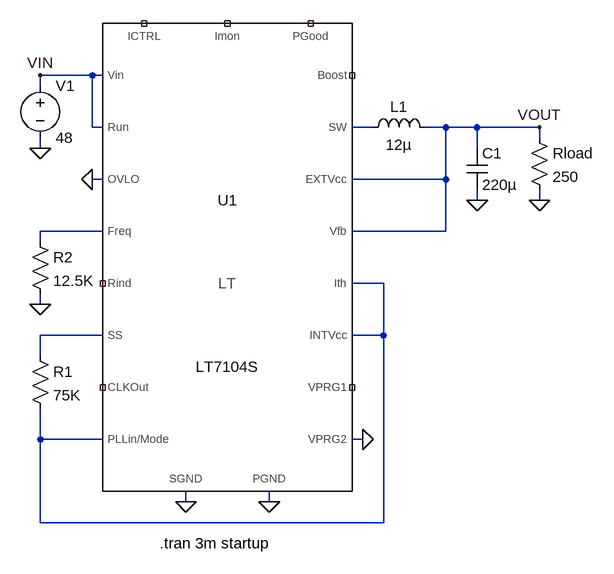
[diagram p0: schematic LT7104S.asc]
LT7104S.asc, the LTspice schematic file:
Version 4
SHEET 1 6140 3124
WIRE 608 -256 528 -256
WIRE 624 -256 608 -256
WIRE 528 -240 528 -256
WIRE 608 -176 608 -256
WIRE 624 -176 608 -176
WIRE 1040 -176 1008 -176
WIRE 1152 -176 1120 -176
WIRE 1200 -176 1152 -176
WIRE 1296 -176 1200 -176
WIRE 1296 -160 1296 -176
WIRE 528 -144 528 -160
WIRE 1200 -144 1200 -176
WIRE 624 -96 608 -96
WIRE 1152 -96 1152 -176
WIRE 1152 -96 1008 -96
WIRE 1200 -64 1200 -80
WIRE 1296 -64 1296 -80
WIRE 624 -16 528 -16
WIRE 1152 -16 1152 -96
WIRE 1152 -16 1008 -16
WIRE 528 0 528 -16
WIRE 1056 64 1008 64
WIRE 528 96 528 80
WIRE 624 144 528 144
WIRE 1056 144 1056 64
WIRE 1056 144 1008 144
WIRE 528 176 528 144
WIRE 528 304 528 256
WIRE 624 304 528 304
WIRE 1024 304 1008 304
WIRE 752 400 752 384
WIRE 880 400 880 384
WIRE 528 432 528 304
WIRE 1056 432 1056 144
WIRE 1056 432 528 432
FLAG 528 -144 0
FLAG 1296 -176 VOUT
FLAG 608 -96 0
FLAG 1296 -64 0
FLAG 1200 -64 0
FLAG 752 400 0
FLAG 880 400 0
FLAG 1024 304 0
FLAG 528 -256 VIN
FLAG 528 96 0
SYMBOL ind 1024 -160 R270
WINDOW 0 32 56 VTop 2
WINDOW 3 5 56 VBottom 2
SYMATTR InstName L1
SYMATTR Value 12µ
SYMATTR SpiceLine Rser=5m
SYMBOL cap 1184 -144 R0
SYMATTR Value 220µ
SYMATTR SpiceLine Rser=15m
SYMATTR InstName C1
SYMBOL voltage 528 -256 R0
WINDOW 123 0 0 Left 0
WINDOW 39 0 0 Left 0
SYMATTR InstName V1
SYMATTR Value 48
SYMBOL res 1280 -176 R0
SYMATTR InstName Rload
SYMATTR Value 250
SYMBOL res 512 -16 R0
SYMATTR InstName R2
SYMATTR Value 12.5K
SYMBOL res 512 160 R0
SYMATTR InstName R1
SYMATTR Value 75K
SYMBOL LT7104S 816 48 R0
SYMATTR InstName U1
TEXT 712 464 Left 2 !.tran 3m startup

The netlist it stands for:
* LT7104S.asc
L1 N001 VOUT 12µ Rser=5m
C1 VOUT 0 220µ Rser=15m
V1 VIN 0 48
Rload VOUT 0 250
R2 N002 0 12.5K
R1 N004 N003 75K
XU1 N001 NC_01 VIN VIN 0 0 0 NC_02 N003 VOUT N002 N003 NC_03 NC_04 N004 NC_05 NC_06 NC_07 0 VOUT N003 LT7104S  ; pins SW Boost Run Vin PGND SGND OVLO Rind Ith Vfb Freq PLLin/Mode CLKOut PGood SS ICTRL Imon VPRG1 VPRG2 EXTVcc INTVcc
.tran 3m startup
.lib LT7104S.sub
.backanno
.end